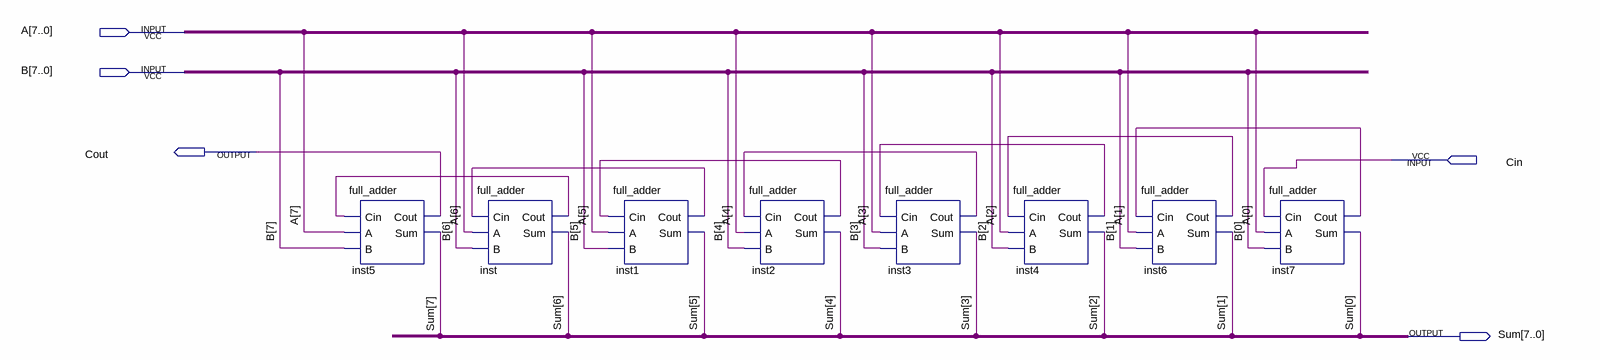
[diagram p0: schematic sheet]
// Quartus schematic full_adder8bit.bdf as structural Verilog: 8 symbols, 5 pins
module full_adder8bit (
  input  [7:0] A,
  input  [7:0] B,
  input  Cin,
  output Cout,
  output [7:0] Sum
);

  wire inst1_cout, inst2_cout, inst3_cout, inst4_cout, inst6_cout, inst7_cout, inst_cout;

  full_adder inst5 (.Cin(inst_cout), .A(A[7]), .B(B[7]), .Cout(Cout), .Sum(Sum[7]));
  full_adder inst (.Cin(inst1_cout), .A(A[6]), .B(B[6]), .Cout(inst_cout), .Sum(Sum[6]));
  full_adder inst1 (.Cin(inst2_cout), .A(A[5]), .B(B[5]), .Cout(inst1_cout), .Sum(Sum[5]));
  full_adder inst2 (.Cin(inst3_cout), .A(A[4]), .B(B[4]), .Cout(inst2_cout), .Sum(Sum[4]));
  full_adder inst3 (.Cin(inst4_cout), .A(A[3]), .B(B[3]), .Cout(inst3_cout), .Sum(Sum[3]));
  full_adder inst4 (.Cin(inst6_cout), .A(A[2]), .B(B[2]), .Cout(inst4_cout), .Sum(Sum[2]));
  full_adder inst6 (.Cin(inst7_cout), .A(A[1]), .B(B[1]), .Cout(inst6_cout), .Sum(Sum[1]));
  full_adder inst7 (.Cin(Cin), .A(A[0]), .B(B[0]), .Cout(inst7_cout), .Sum(Sum[0]));
endmodule
